# EasyEDA schematic Schematic_Equipment control and gateway system.json
TITLE: EQUIPMENT CONTROL SYSTEM AND GATEWAY SYSTEM; REV: 1.0; Date: 2025-03-30; Sheet: 1/1; Drawn By: DO PHUC DUY
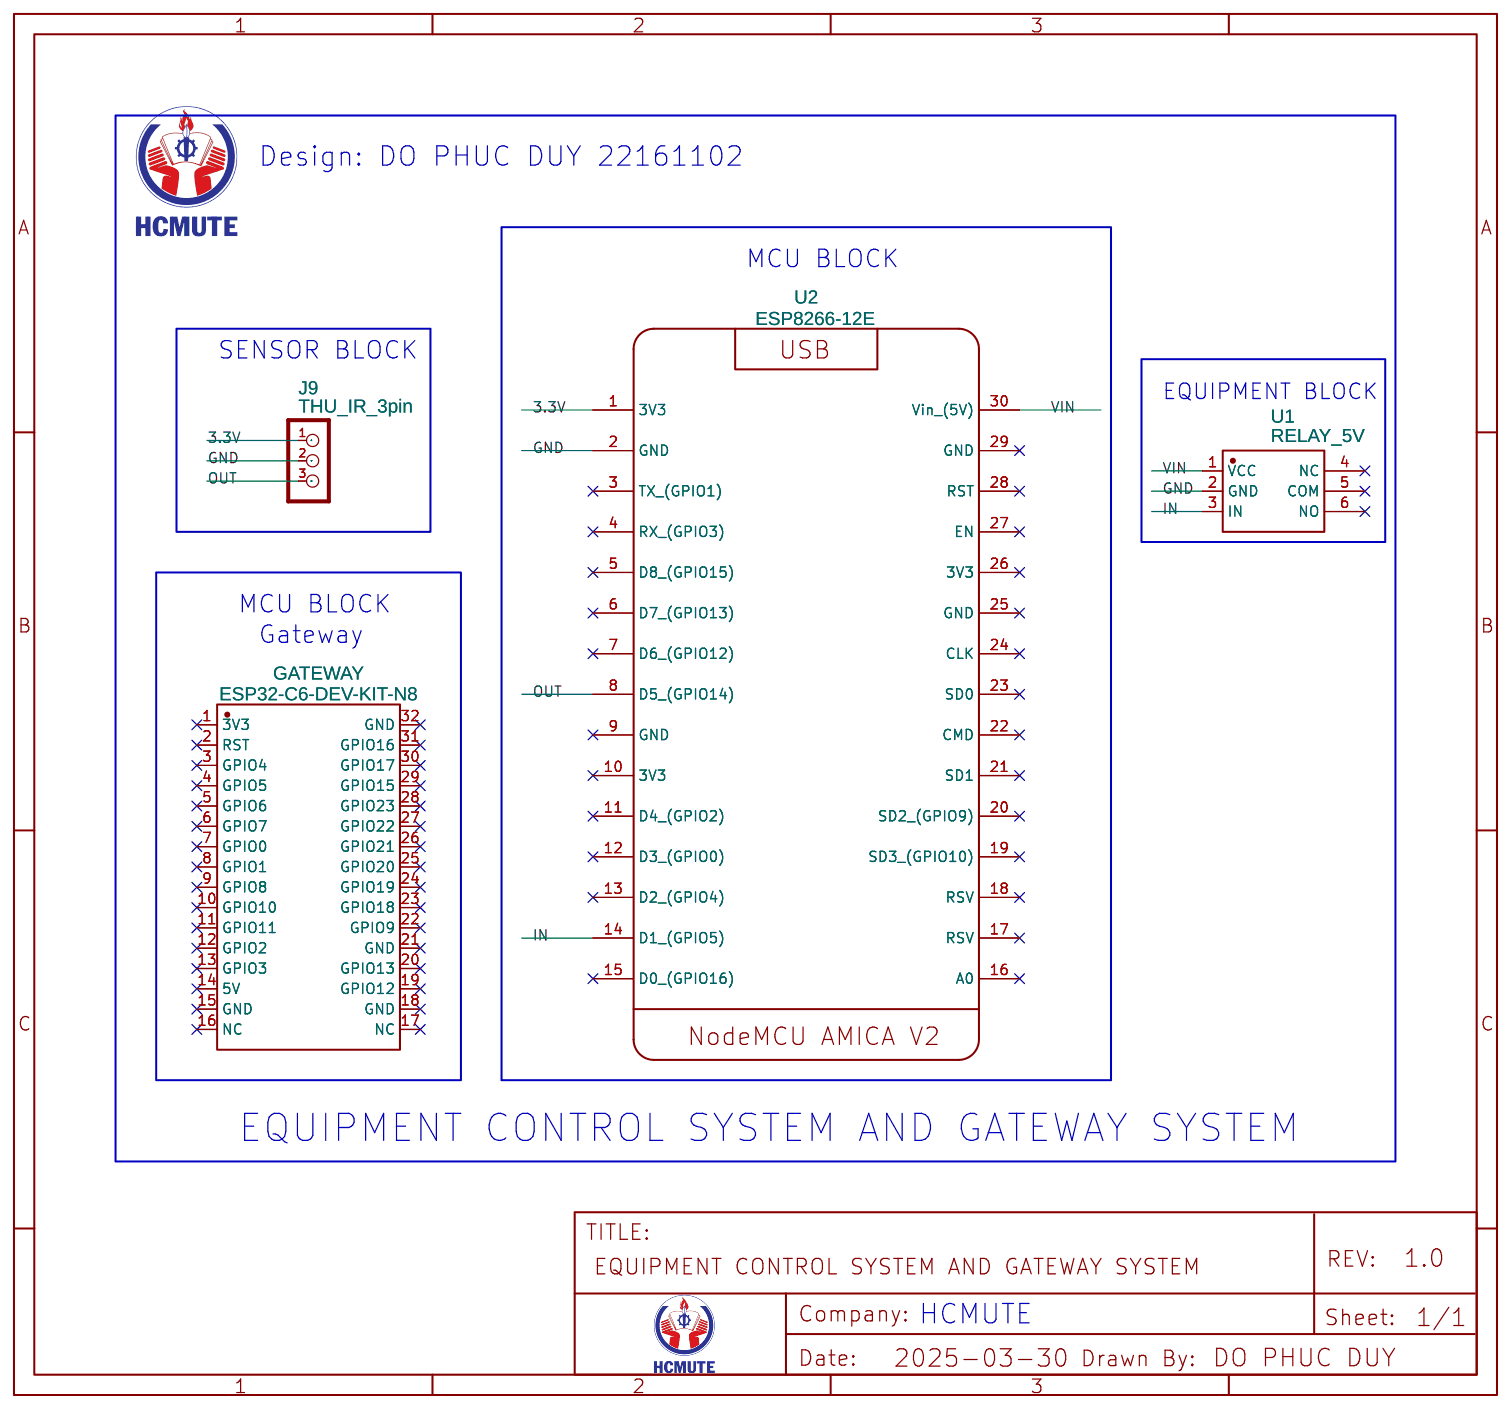
[diagram p0: schematic sheet]

## Parts
GATEWAY  ESP32-C6-DEV-KIT-N8  [COMM-SMD_L55.0-W25.4_ESP32-C6-DEV-KIT-N8]
J9  THU_IR_3pin  [M1X3]
U1  RELAY_5V  [RELAY MODULE LOW/HIGH - PCB]
U2  ESP8266-12E  [NODEMCU ESP8266-12E AMICA V2]

## Library data of the parts
GATEWAY = ESP32-C6-DEV-KIT-N8: Supplier: LCSC; Supplier Part: C9900125030; Manufacturer: null; Contributor: lcsc
J9 = CON_HEADER_1X03: Contributor: DangerousPrototype
U1 = RELAY_5V: Manufacturer: China; Manufacturer Part: Monday Kids; Supplier: Aliexpress; link: https://www.mondaykids.com/monday-kids-1-channel-relay-module-with-optocoupler-isolation-support-high-and-low-level-trigger-5v.html; Contributor: 22161102
U2 = ESP8266-12E: Contributor: 22161102; Author: Krzysztof Daszuta; sourceId: c4ASM4mEW; Supplier Part: nodemcu-v2; Supplier: Nettigo

## Nets
3.3V: J9.1 U2.1(3V3)
GND: J9.2 U1.2(GND) U2.2(GND)
VIN: U1.1(VCC) U2.30(Vin (5V))
IN: U1.3(IN) U2.14(D1 (GPIO5))
OUT: J9.3 U2.8(D5 (GPIO14))

Not connected (* = marked no-connect by the designer): GATEWAY 1(3V3)* 2(RST)* 3(GPIO4)* 4(GPIO5)* 5(GPIO6)* 6(GPIO7)* 7(GPIO0)* 8(GPIO1)* 9(GPIO8)* 10(GPIO10)* 11(GPIO11)* 12(GPIO2)* 13(GPIO3)* 14(5V)* 15(GND)* 16(NC)* 17(NC)* 18(GND)* 19(GPIO12)* 20(GPIO13)* 21(GND)* 22(GPIO9)* 23(GPIO18)* 24(GPIO19)* 25(GPIO20)* 26(GPIO21)* 27(GPIO22)* 28(GPIO23)* 29(GPIO15)* 30(GPIO17)* 31(GPIO16)* 32(GND)*; U1 4(NC)* 5(COM)* 6(NO)*; U2 3(TX (GPIO1))* 4(RX (GPIO3))* 5(D8 (GPIO15))* 6(D7 (GPIO13))* 7(D6 (GPIO12))* 9(GND)* 10(3V3)* 11(D4 (GPIO2))* 12(D3 (GPIO0))* 13(D2 (GPIO4))* 15(D0 (GPIO16))* 16(A0)* 17(RSV)* 18(RSV)* 19(SD3 (GPIO10))* 20(SD2 (GPIO9))* 21(SD1)* 22(CMD)* 23(SD0)* 24(CLK)* 25(GND)* 26(3V3)* 27(EN)* 28(RST)* 29(GND)*

## Notes on the sheet
- Design: DO PHUC DUY 22161102
- MCU BLOCK
- SENSOR BLOCK
- EQUIPMENT BLOCK
- MCU BLOCK
- Gateway
- EQUIPMENT CONTROL SYSTEM AND GATEWAY SYSTEM
- HCMUTE
